# Altium schematic sheet [01] Title Page.SchDoc
size B
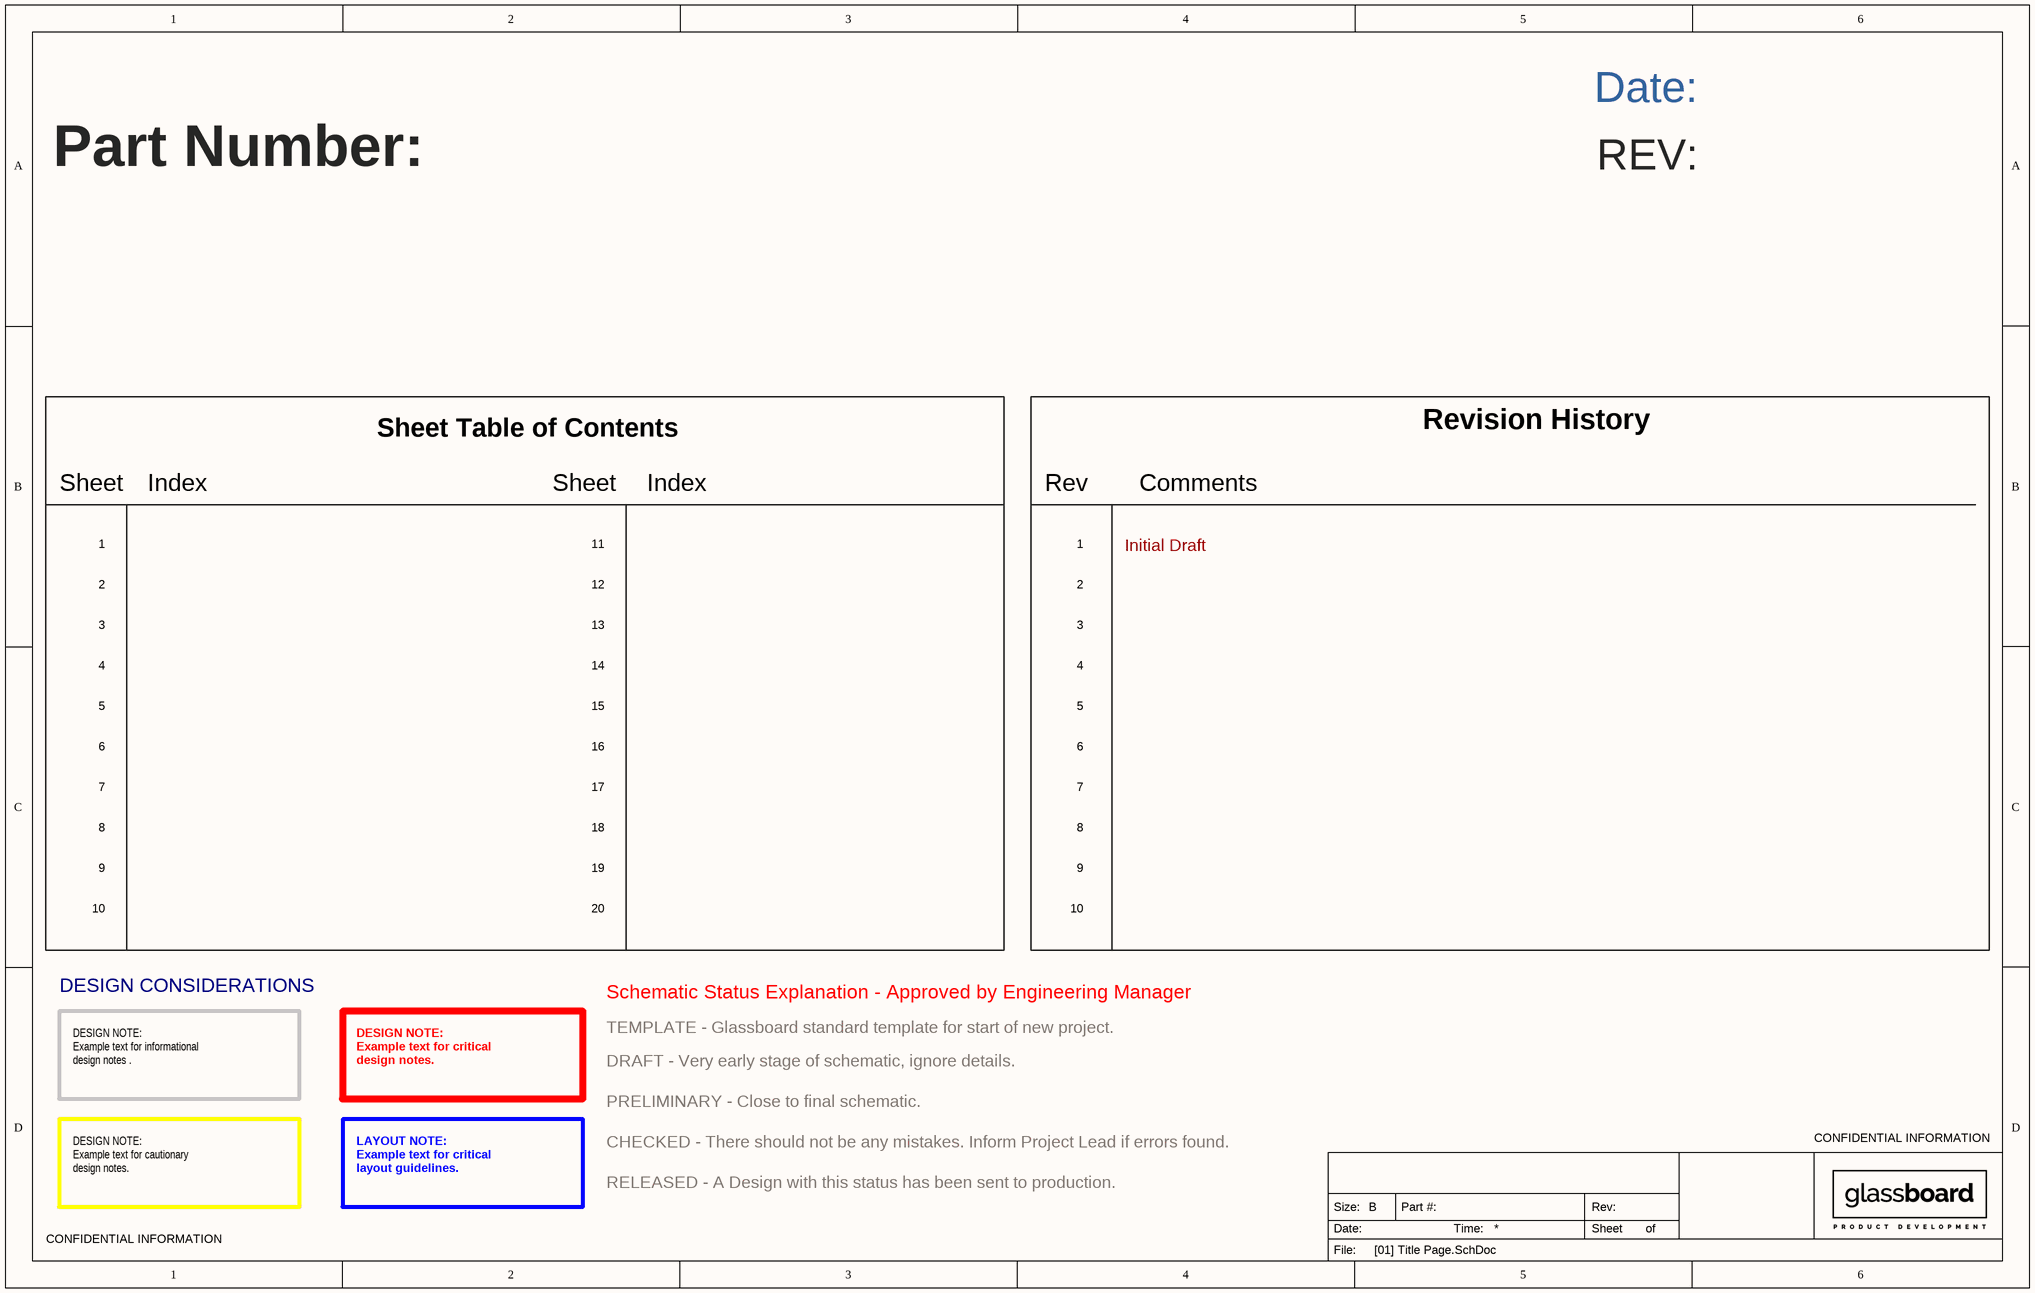
[diagram p0: [01] Title Page.SchDoc]

## Notes on the sheet
- Date:
- Part Number:
- REV:
- Revision History
- Sheet
- Index
- Sheet Table of Contents
- Rev
- Comments
- 1
- 11
- Initial Draft
- 2
- 3
- 12
- 13
- 4
- 14
- 5
- 6
- 15
- 16
- 7
- 8
- 17
- 18
- 9
- 10
- 19
- 20
- DESIGN CONSIDERATIONS
- Schematic Status Explanation - Approved by Engineering Manager
- TEMPLATE - Glassboard standard template for start of new project.
- DESIGN NOTE:
  Example text for informational
  design notes .
- DESIGN NOTE:
  Example text for critical
  design notes.
- PRELIMINARY - Close to final schematic.
- DRAFT - Very early stage of schematic, ignore details.
- CHECKED - There should not be any mistakes. Inform Project Lead if errors found.
- CONFIDENTIAL INFORMATION
- DESIGN NOTE:
  Example text for cautionary
  design notes.
- LAYOUT NOTE:
  Example text for critical
  layout guidelines.
- RELEASED - A Design with this status has been sent to production.
- Size:
- B
- Part #:
- Time:
- Rev:
- of
- File: